# Altium schematic sheet 4_Protection.SchDoc
size A; SheetNumber: 5; SheetTotal: 5
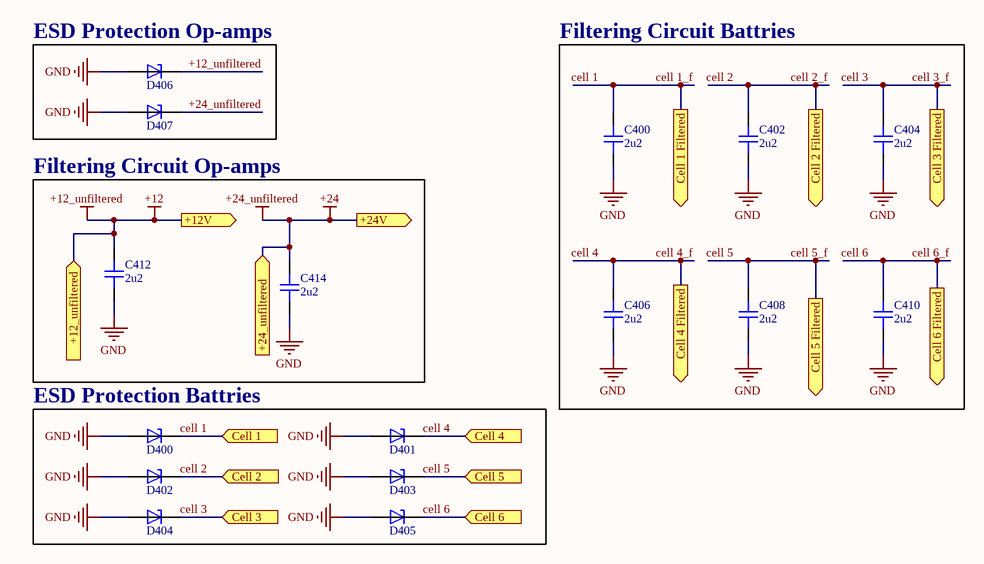
[diagram p0: 4_Protection.SchDoc]

## Parts
C400  2u2  [CAP_1206]
C402  2u2  [CAP_1206]
C404  2u2  [CAP_1206]
C406  2u2  [CAP_1206]
C408  2u2  [CAP_1206]
C410  2u2  [CAP_1206]
C412  2u2  [CAP_1206]
C414  2u2  [CAP_1206]
D400  TVS-P6KE400A  [TVS]  (value not drawn)
D401  TVS-P6KE400A  [TVS]  (value not drawn)
D402  TVS-P6KE400A  [TVS]  (value not drawn)
D403  TVS-P6KE400A  [TVS]  (value not drawn)
D404  TVS-P6KE400A  [TVS]  (value not drawn)
D405  TVS-P6KE400A  [TVS]  (value not drawn)
D406  TVS-P6KE400A  [TVS]  (value not drawn)
D407  TVS-P6KE400A  [TVS]  (value not drawn)

## Blocks framed on the sheet
ESD Protection Op-amps: D406 D407
Filtering Circuit Battries: C400 C402 C404 C406 C408 C410
Filtering Circuit Op-amps: C412 C414
ESD Protection Battries: D400-D405

## Ports
+12_unfiltered (in), +12V (out, see 0_overview[4B], 2_CircuitBreaker[2A]), +24_unfiltered (in, see 0_overview[3B], 1_Power[1B]), +24V (out, see 0_overview[4B], 2_CircuitBreaker[4A]), Cell 1 (in, see 0_overview[3A], 3_BMS[3A]), Cell 1 Filtered (out, see 0_overview[4A], 3_BMS[1B]), Cell 2 (in, see 0_overview[3A], 3_BMS[3A]), Cell 2 Filtered (out, see 0_overview[4B]), Cell 3 (in, see 0_overview[3B], 3_BMS[3A]), Cell 3 Filtered (out, see 0_overview[4B]), Cell 4 (in, see 0_overview[3B], 3_BMS[3A]), Cell 4 Filtered (out, see 0_overview[4A]), Cell 5 (in, see 0_overview[3B], 3_BMS[3A]), Cell 5 Filtered (out, see 0_overview[4B]), Cell 6 (in, see 0_overview[3B], 3_BMS[3A]), Cell 6 Filtered (out, see 0_overview[4B])

## Nets
+12_unfiltered: C412.2 D406.C ; port +12V, port +12_unfiltered  [also labelled +12]
+24_unfiltered: C414.2 D407.C ; port +24_unfiltered, port +24V  [also labelled +24]
GND: C400.1 C402.1 C404.1 C406.1 C408.1 C410.1 C412.1 C414.1 D400.A D401.A D402.A D403.A D404.A D405.A D406.A D407.A
cell 1: C400.2 D400.C ; port Cell 1, port Cell 1 Filtered  [also labelled cell 1_f]
cell 2: C402.2 D402.C ; port Cell 2, port Cell 2 Filtered  [also labelled cell 2_f]
cell 3: C404.2 D404.C ; port Cell 3, port Cell 3 Filtered  [also labelled cell 3_f]
cell 4: C406.2 D401.C ; port Cell 4, port Cell 4 Filtered  [also labelled cell 4_f]
cell 5: C408.2 D403.C ; port Cell 5, port Cell 5 Filtered  [also labelled cell 5_f]
cell 6: C410.2 D405.C ; port Cell 6, port Cell 6 Filtered  [also labelled cell 6_f]

## Library data of the parts
C400 C402 C404 C406 C408 C410 C412 C414 = CAP_1206: Capacitor SMD 1206; Manufacturer: *; Manufacturer Part Number: *; Distributor Link: *; LCSC: *; Rating: *; Dielectric: *